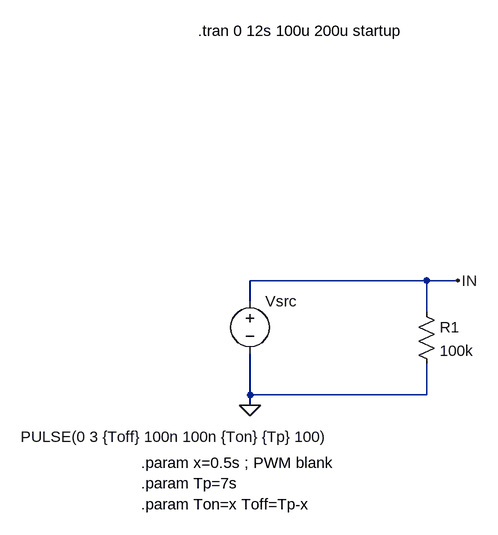
[diagram p0: schematic V0_slow_timer.asc]
V0_slow_timer.asc, the LTspice schematic file:
Version 4
SHEET 1 880 680
WIRE 480 32 208 32
WIRE 528 32 480 32
WIRE 208 64 208 32
WIRE 480 80 480 32
WIRE 208 208 208 144
WIRE 480 208 480 160
WIRE 480 208 208 208
WIRE 208 224 208 208
FLAG 208 224 0
FLAG 528 32 IN
DATAFLAG 560 32 ""
SYMBOL voltage 208 48 R0
WINDOW 3 -353 224 Left 2
WINDOW 123 0 0 Left 0
WINDOW 39 0 0 Left 0
SYMATTR Value PULSE(0 3 {Toff} 100n 100n {Ton} {Tp} 100)
SYMATTR InstName Vsrc
SYMBOL res 464 64 R0
SYMATTR InstName R1
SYMATTR Value 100k
TEXT 40 312 Left 2 !.param x=0.5s ; PWM blank
TEXT 128 -352 Left 2 !.tran 0 12s 100u 200u startup
TEXT 40 376 Left 2 !.param Ton=x Toff=Tp-x
TEXT 40 344 Left 2 !.param Tp=7s

The netlist it stands for:
* V0_slow_timer.asc
Vsrc IN 0 PULSE(0 3 {Toff} 100n 100n {Ton} {Tp} 100)
R1 IN 0 100k
.param x=0.5s ; PWM blank
.tran 0 12s 100u 200u startup
.param Ton=x Toff=Tp-x
.param Tp=7s
.backanno
.end